# Altium schematic sheet USB HUB.SchDoc
size 297 x 209 mm; SheetNumber: 7; SheetTotal: 29
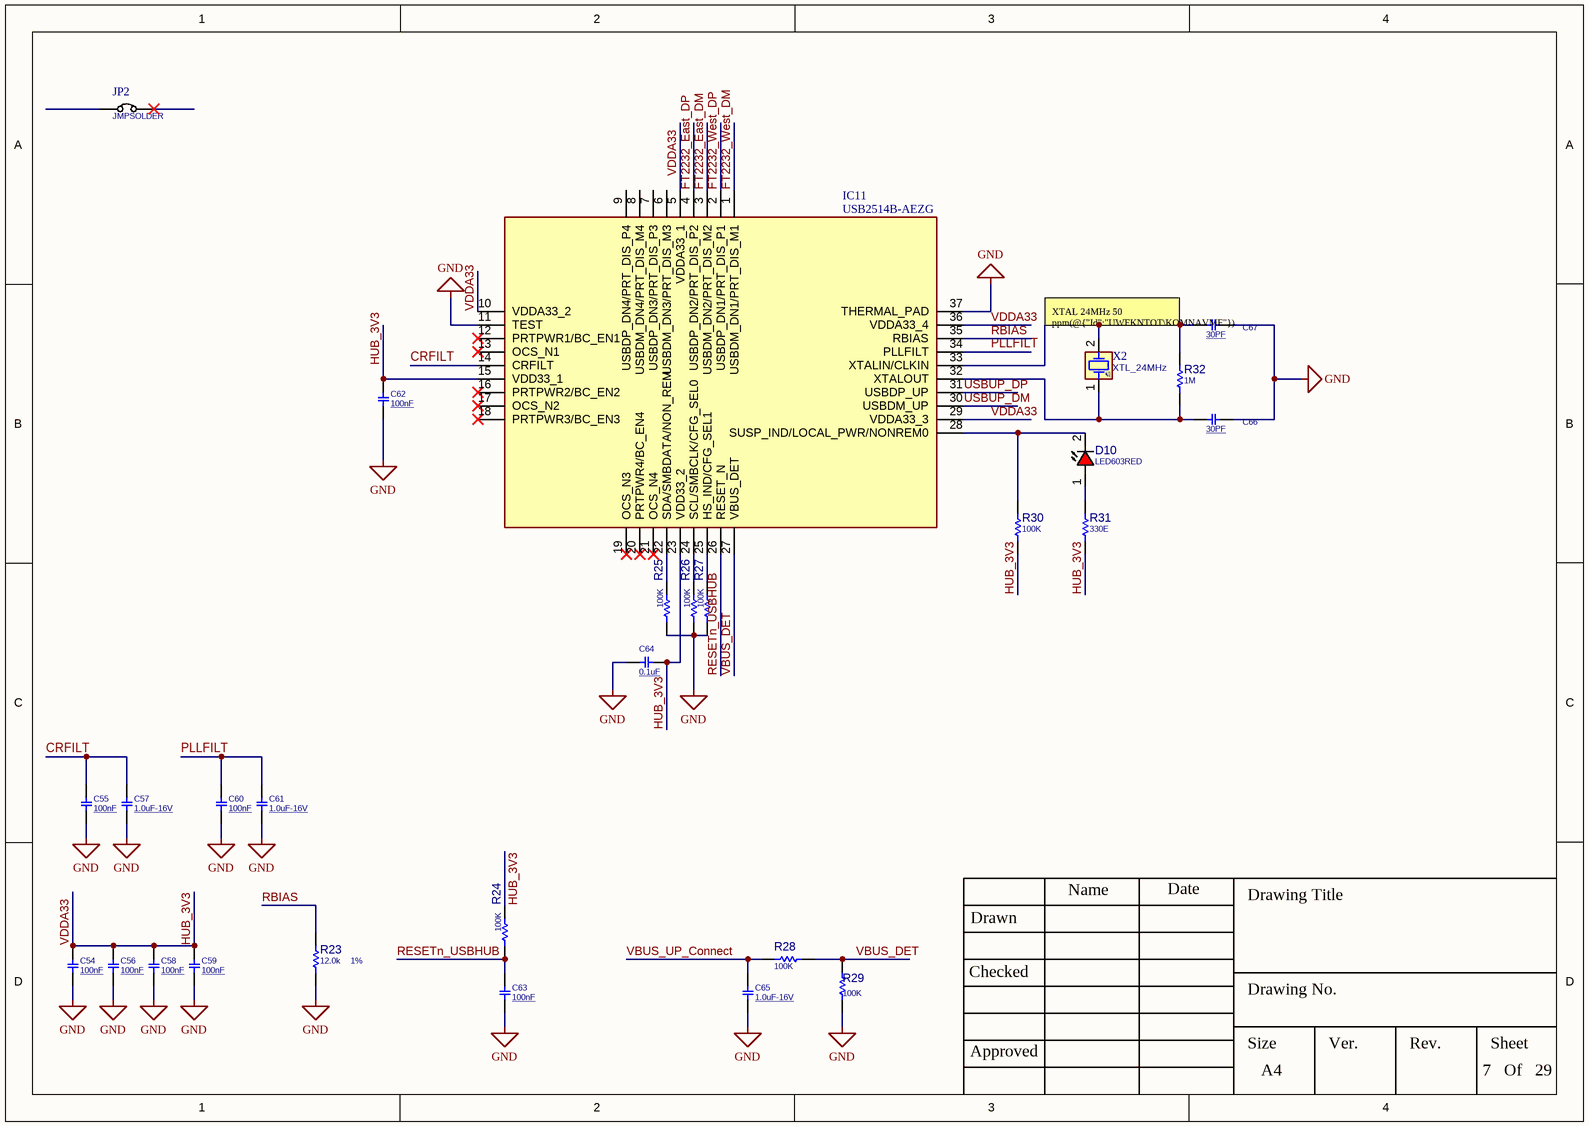
[diagram p0: USB HUB.SchDoc]

## Parts
C54  100nF  [0603]
C55  100nF  [0603]
C56  100nF  [0603]
C57  1.0uF-16V  [0603]
C58  100nF  [0603]
C59  100nF  [0603]
C60  100nF  [0603]
C61  1.0uF-16V  [0603]
C62  100nF  [0603]
C63  100nF  [0603]
C64  0.1uF  [0603]
C65  1.0uF-16V  [0603]
C66  30PF  [C0805]
C67  30PF  [C0805]
D10  LED603RED  [LED0603RED]
IC11  USB2514B-AEZG  [QFN50P600X600X100-37N-D]
JP2  JMPSOLDER  [JP_40X50]
R23  12.0k    1%  [R0603]
R24  100K  [R0603]
R25  100K  [R0603]
R26  100K  [R0603]
R27  100K  [R0603]
R28  100K  [R0603]
R29  100K  [R0603]
R30  100K  [R0603]
R31  330E  [R0603]
R32  1M  [R0603]
X2  XTL_24MHz  [XTL_2_11X5]

## Nets
GND: C54.1 C55.2 C56.1 C57.2 C58.1 C59.1 C60.2 C61.2 C62.1 C63.2 C64.2 C65.2 C66.2 C67.2 IC11.11(TEST) IC11.37(THERMAL_PAD) R23.1 R25.1 R26.1 R27.1 R29.1
CRFILT: C55.1 C57.1 IC11.14(CRFILT)
FT2232_East_DM: IC11.3(USBDM_DN2/PRT_DIS_M2)
FT2232_East_DP: IC11.4(USBDP_DN2/PRT_DIS_P2)
FT2232_West_DM: IC11.1(USBDM_DN1/PRT_DIS_M1)
FT2232_West_DP: IC11.2(USBDP_DN1/PRT_DIS_P1)
HUB_3V3: C54.2 C56.2 C58.2 C59.2 C62.2 C64.1 IC11.5(VDDA33_1) IC11.10(VDDA33_2) IC11.15(VDD33_1) IC11.23(VDD33_2) IC11.29(VDDA33_3) IC11.36(VDDA33_4) R24.2 R30.1 R31.1  [also labelled VDDA33]
PLLFILT: C60.1 C61.1 IC11.34(PLLFILT)
RBIAS: IC11.35(RBIAS) R23.2
RESETn_USBHUB: C63.1 IC11.26(RESET_N) R24.1
USBUP_DM: IC11.30(USBDM_UP)
USBUP_DP: IC11.31(USBDP_UP)
VBUS_DET: IC11.27(VBUS_DET) R28.2 R29.2
VBUS_UP_Connect: C65.1 R28.1
NetC66_1: C66.1 IC11.32(XTALOUT) R32.1 X2.1(OSC1)
NetC67_1: C67.1 IC11.33(XTALIN/CLKIN) R32.2 X2.2(OSC2)
NetD10_1: D10.1(ANODE) R31.2
NetD10_2: D10.2(CATHODE) IC11.28(SUSP_IND/LOCAL_PWR/NONREM0) R30.2
NetIC11_22: IC11.22(SDA/SMBDATA/NON_REM) R25.2
NetIC11_24: IC11.24(SCL/SMBCLK/CFG_SEL0) R26.2
NetIC11_25: IC11.25(HS_IND/CFG_SEL1) R27.2

Not connected (* = marked no-connect by the designer): IC11 6(USBDM_DN3/PRT_DIS_M3) 7(USBDP_DN3/PRT_DIS_P3) 8(USBDM_DN4/PRT_DIS_M4) 9(USBDP_DN4/PRT_DIS_P4) 12(PRTPWR1/BC_EN1)* 13(OCS_N1)* 16(PRTPWR2/BC_EN2)* 17(OCS_N2)* 18(PRTPWR3/BC_EN3)* 19(OCS_N3)* 20(PRTPWR4/BC_EN4)* 21(OCS_N4)*; JP2 1 2*

## Notes on the sheet
- XTAL 24MHz 50 ppm(@{"Id":"UWFKNTOT\KOMNAVMF"})
- Drawn
- Name
- Date
- Drawing Title
- Checked
- Drawing No.
- Approved
- Size
- A4
- Ver.
- Rev.
- Sheet
- Of

## Library data of the parts
C54-C65 = CAP_SMD_FILM_1u16v_1210: CAP, FILM, 1uF, 16V, Acryl, 20%, 1210; PARAM: Acrylic, MetallizedStacked, 20%, -40~85oC; MANF_P#: ECP-U1C105MA5; MANF: Panasonic; PRICE: 100= 36$; DESC: -; PARAM2: 16V; ASSEMBLY: ASSEMBLY
  C54-C56 C58-C60 C62 C63: VALUE: 100nF
  C57 C61 C65: VALUE: 1.0uF-16V
  C64: VALUE: 0.1uF
C66 C67 = CAP_SMD_MLCC: CAP, MLCC, 1nF, 50V, C0G, 10%, 0402; MANF: Murata; PARAM: C0G, 10%; PRICE: 100= 1.4$; DESC: -; MANF_P#: -; PARAM2: 50V; ASSEMBLY: ASSEMBLY; VALUE: 30PF
D10 = LED_SMD_0603_RED: LED, SMD, 0603, RED; PARAM: 30mA, 640nm; DESC: DESCRIPTION; MANF_P#: MANF_PART#; PARAM2: 1.8~2.5V; MANF: MANF; ASSEMBLY: ASSEMBLY; PRICE: PRICE; VALUE: LED603RED
IC11 = USB2514B-AEZG: Integrated Circuit; Manufacturer_Name: Microchip; Datasheet Link: http://ww1.microchip.com/downloads/en/DeviceDoc/00001692C.pdf; Height: 1mm; Manufacturer_Part_Number: USB2514B-AEZG; Mouser Part Number: 886-USB2514B-AEZG; Mouser Price/Stock: https://www.mouser.co.uk/ProductDetail/Microchip-Technology/USB2514B-AEZG?qs=ydWXD%252B8LvLCxuNqQPTEcVA%3D%3D; Arrow Part Number: USB2514B-AEZG; Arrow Price/Stock: https://www.arrow.com/en/products/usb2514b-aezg/microchip-technology?region=nac
JP2 = JUMPER_SOLDER: JUMPER, HEADER 2PIN; MANF: MANF; MANF_P#: MANF_P#; VALUE: JMPSOLDER
R23 = RES_SMD_0603: RESISTOR, SMD; PARAM: -W; DESC: DESCRIPTION; DIST#: MOUSER; MANF_P#: -; MANF: -; ASSEMBLY: ASSEMBLY; PRICE: 100= 0.5$; PARAM2: 1%; VALUE: 12.0k    1%
R24-R32 = RES_SMD_0603: RESISTOR, SMD; PARAM: -W; DESC: DESCRIPTION; DIST#: MOUSER; PARAM2: 1%; MANF_P#: -; MANF: -; ASSEMBLY: ASSEMBLY; PRICE: 100= 0.5$
  R24-R30: VALUE: 100K
  R31: VALUE: 330E
  R32: VALUE: 1M
X2 = XTL_2_HC49_8MHz_SMD: Crystal MOST POPULAR ABL HC49 PACKAGE; MANF: ABRACON; MANF_P#: ABLS-8.000MHZ-B4-T; PARAM: 8MHz, 18pF, 30PPM, -20~70oC; PRICE: 0.3$; VALUE: XTL_24MHz